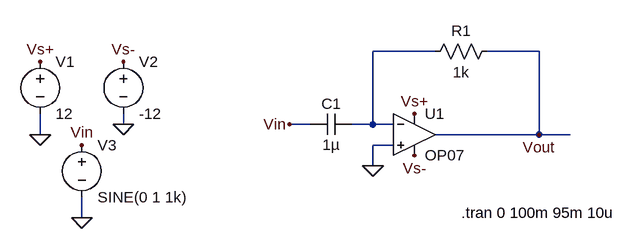
[diagram p0: schematic Task 6.asc]
Task 6.asc, the LTspice schematic file:
Version 4
SHEET 1 880 680
WIRE 544 32 448 32
WIRE 704 32 624 32
WIRE 64 144 64 128
WIRE 352 144 320 144
WIRE 448 144 448 32
WIRE 448 144 416 144
WIRE 480 144 448 144
WIRE -64 160 -64 128
WIRE 704 160 704 32
WIRE 704 160 544 160
WIRE 752 160 704 160
WIRE 480 176 448 176
WIRE 448 208 448 176
WIRE 0 288 0 256
FLAG 448 208 0
FLAG 0 288 0
FLAG -64 160 0
FLAG 64 144 0
FLAG 320 144 Vin
FLAG 0 176 Vin
FLAG -64 48 Vs+
FLAG 512 128 Vs+
FLAG 64 48 Vs-
FLAG 512 192 Vs-
FLAG 704 160 Vout
SYMBOL voltage -64 32 R0
WINDOW 123 0 0 Left 0
WINDOW 39 0 0 Left 0
SYMATTR InstName V1
SYMATTR Value 12
SYMBOL voltage 64 32 R0
WINDOW 123 0 0 Left 0
WINDOW 39 0 0 Left 0
SYMATTR InstName V2
SYMATTR Value -12
SYMBOL voltage 0 160 R0
WINDOW 123 0 0 Left 0
WINDOW 39 0 0 Left 0
SYMATTR InstName V3
SYMATTR Value SINE(0 1 1k)
SYMBOL OpAmps\\OP07 512 96 R0
SYMATTR InstName U1
SYMBOL cap 416 128 R90
WINDOW 0 0 32 VBottom 2
WINDOW 3 32 32 VTop 2
SYMATTR InstName C1
SYMATTR Value 1µ
SYMBOL res 640 16 R90
WINDOW 0 0 56 VBottom 2
WINDOW 3 32 56 VTop 2
SYMATTR InstName R1
SYMATTR Value 1k
TEXT 584 280 Left 2 !.tran 0 100m 95m 10u

The netlist it stands for:
* Task 6.asc
V1 Vs+ 0 12
V2 Vs- 0 -12
V3 Vin 0 SINE(0 1 1k)
XU1 0 N001 Vs+ Vs- Vout LT1001  ; OP07, pins In+ In- V+ V- OUT
C1 N001 Vin 1µ
R1 Vout N001 1k
.tran 0 100m 95m 10u
.lib LTC.lib
.backanno
.end